# Altium schematic sheet C-07 PWR MGR.SchDoc
size 513 x 386 mm
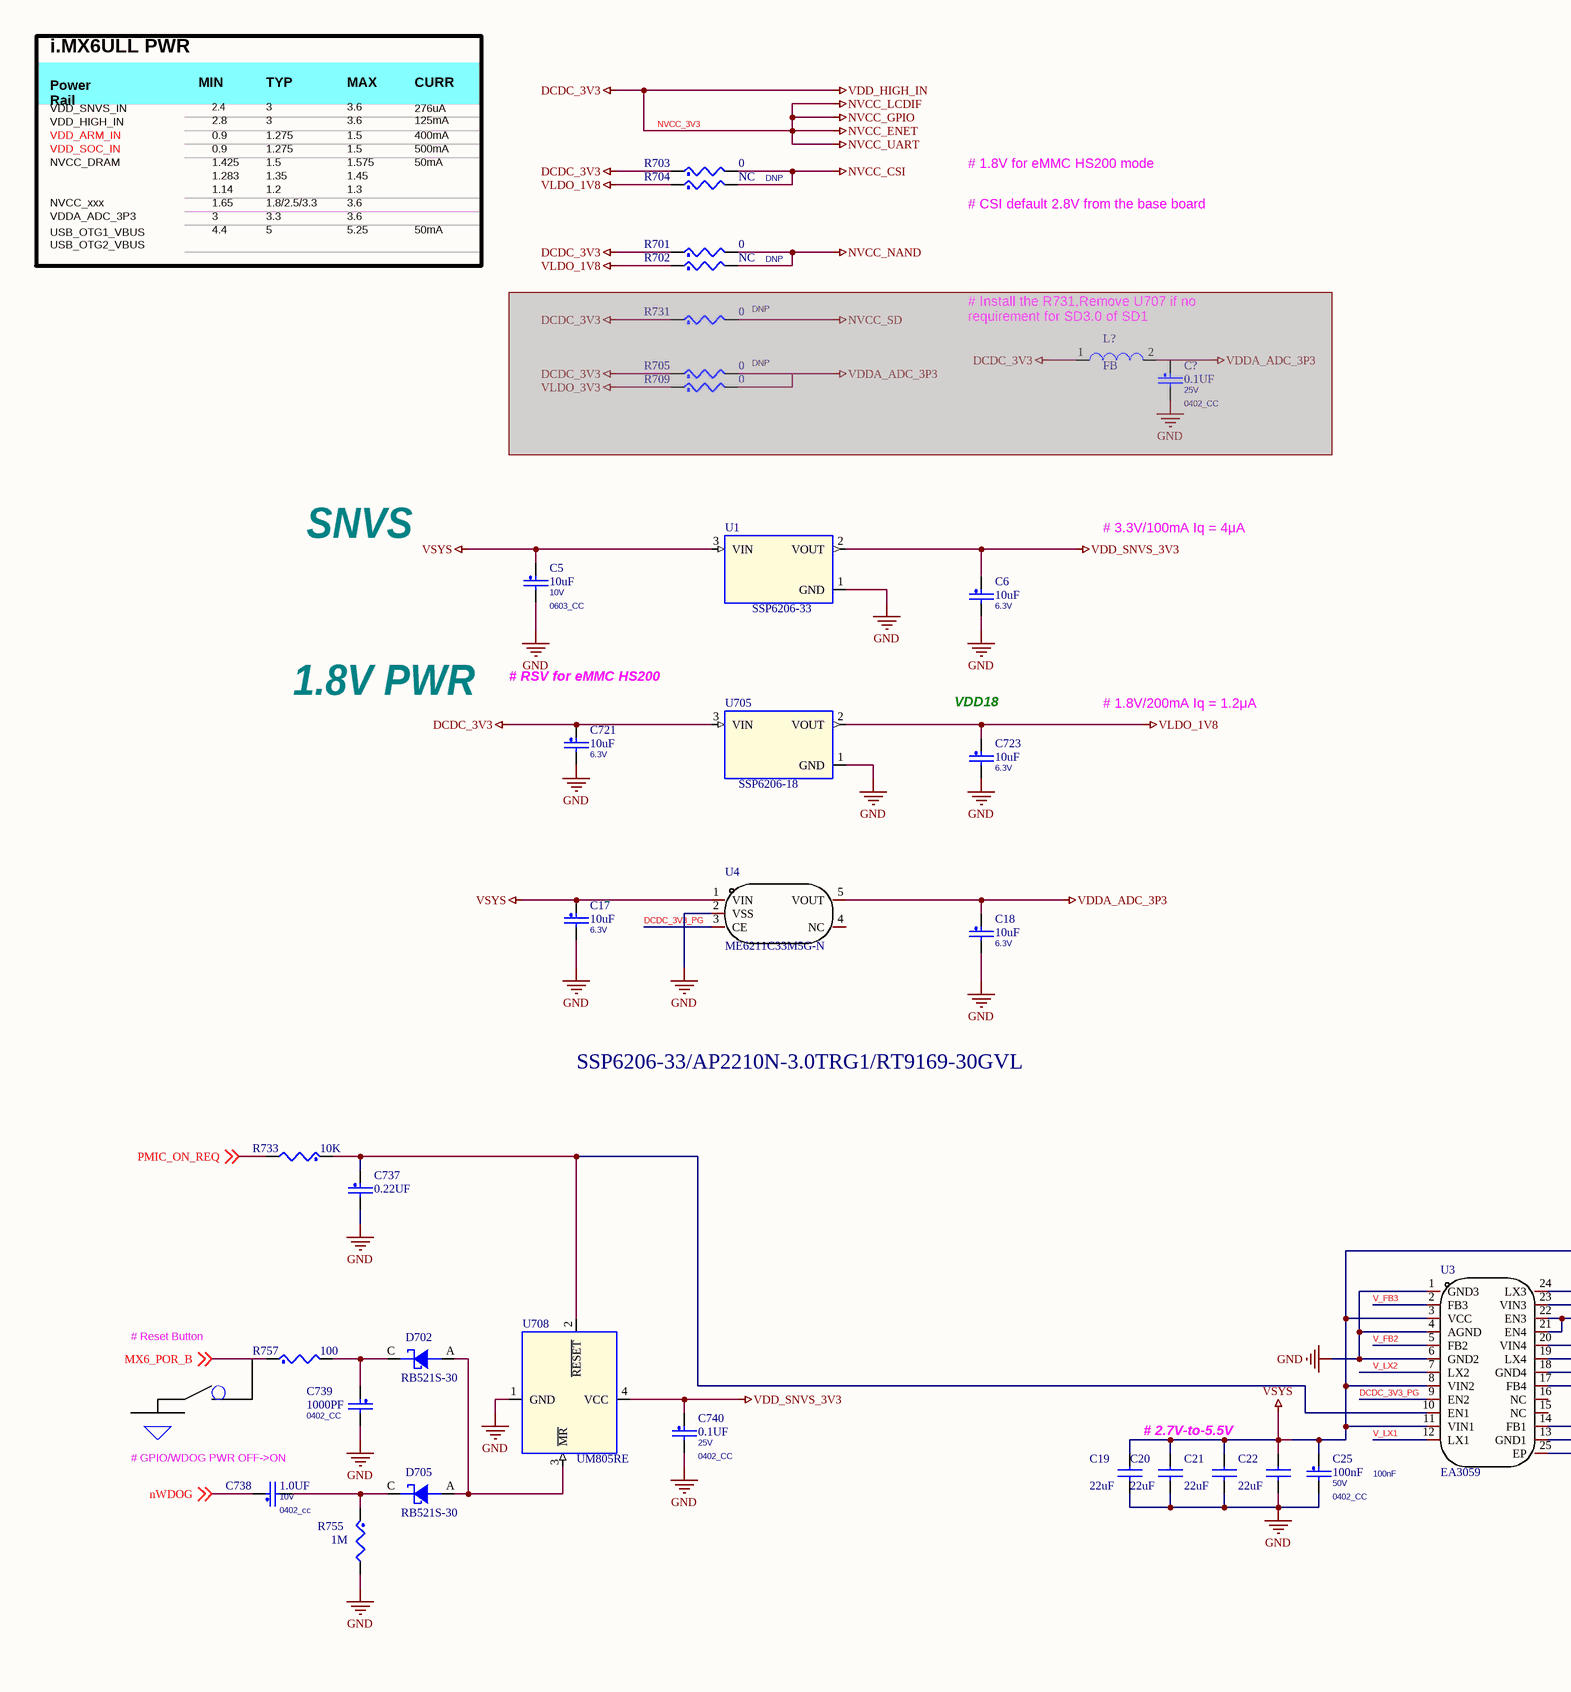
[diagram p0: C-07 PWR MGR.SchDoc, left]
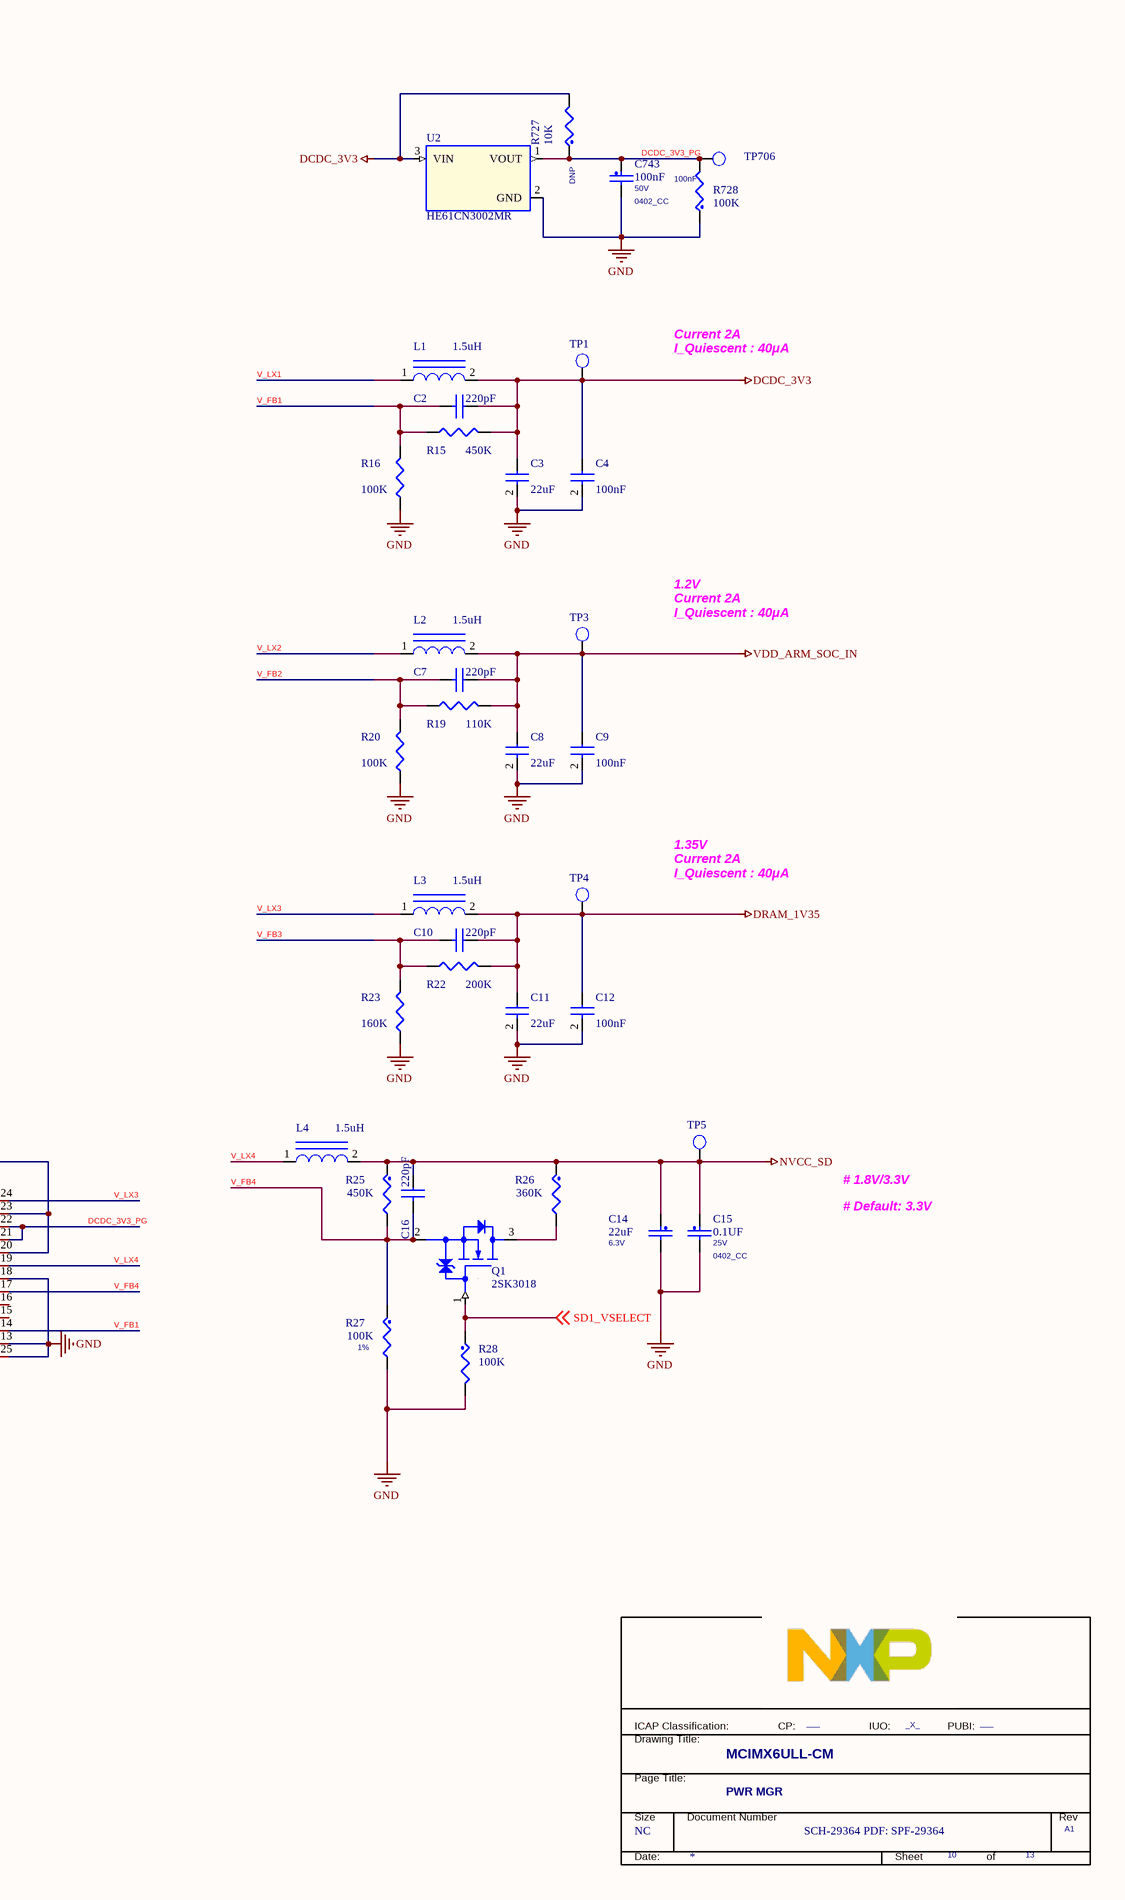
[diagram p1: C-07 PWR MGR.SchDoc, right]

## Parts
*  PageTitle: PWR MGR  Page Count: 13  Page Number: 10  Page Size: NC  Title: MCIMX6ULL-CM  RevCode: A1  Doc: SCH-29364 PDF: SPF-29364  FCP: ___  FIUO: _X_  (hidden comment: TitleBlock_FS)  (graphical)
C2  220pF  [0402T_C]
C3  22uF  [0603_CC]
C4  100nF  [0402T_C]
C5  10uF  VOLTAGE: 10V  PCB Footprint: 0603_CC  [0402T_C]
C6  10uF  voltage rating: 6.3V  [0402T_C]
C7  220pF  [0402T_C]
C8  22uF  [0603_CC]
C9  100nF  [0402T_C]
C10  220pF  [0402T_C]
C11  22uF  [0603_CC]
C12  100nF  [0402T_C]
C14  22uF  voltage rating: 6.3V  [0603_CC]
C15  0.1UF  VOLTAGE: 25V  PCB Footprint: 0402_CC  [0402T_C]
C16  220pF  [0402T_C]
C17  10uF  voltage rating: 6.3V  [0402T_C]
C18  10uF  voltage rating: 6.3V  [0402T_C]
C19  22uF  [0603_CC]
C20  22uF  [0603_CC]
C21  22uF  [0603_CC]
C22  22uF  [0603_CC]
C25  100nF  VOLTAGE: 50V  PCB Footprint: 0402_CC  [0402T_C]
C721  10uF  voltage rating: 6.3V  [0402T_C]
C723  10uF  voltage rating: 6.3V  [0402T_C]
C737  0.22UF  [0402T_C]
C738  1.0UF  VOLTAGE: 10V  PCB Footprint: 0402_cc  [0402T_C]
C739  1000PF  PCB Footprint: 0402_CC  [0402T_C]
C740  0.1UF  VOLTAGE: 25V  PCB Footprint: 0402_CC  [0402T_C]
C743  100nF  VOLTAGE: 50V  PCB Footprint: 0402_CC  [0402T_C]
C?  0.1UF  VOLTAGE: 25V  [0402_CC]  (masked out: inside a compile mask, not in the netlist)
D702  RB521S-30  [SOD-523]
D705  RB521S-30  [SOD-523]
L1  1.5uH  [IND-SMD_L2.5-W2.0_YXMBL252010P]
L2  1.5uH  [IND-SMD_L2.5-W2.0_YXMBL252010P]
L3  1.5uH  [IND-SMD_L2.5-W2.0_YXMBL252010P]
L4  1.5uH  [IND-SMD_L2.5-W2.0_YXMBL252010P]
L?  FB  [L0603]  (masked out: inside a compile mask, not in the netlist)
Q1  2SK3018  [SOT-23]
R15  450K  [0402T_C]
R16  100K  [0402T_C]
R19  110K  [0402T_C]
R20  100K  [0402T_C]
R22  200K  [0402T_C]
R23  160K  [0402T_C]
R25  450K  [0402T_C]
R26  360K  [0402T_C]
R27  100K  Tolerance: 1%  [0402T_C]
R28  100K  [0402T_C]
R701  0  [0402T_C]
R702  NC  ASSY_OPT: DNP  [0402T_C]
R703  0  [0402T_C]
R704  NC  ASSY_OPT: DNP  [0402T_C]
R705  0  ASSY_OPT: DNP  [0402_CC]  (masked out: inside a compile mask, not in the netlist)
R709  0  [0402_CC]  (masked out: inside a compile mask, not in the netlist)
R727  10K  ASSY_OPT: DNP  [0402T_C]
R728  100K  [0402T_C]
R731  0  ASSY_OPT: DNP  [0402_CC]  (masked out: inside a compile mask, not in the netlist)
R733  10K  [0402T_C]
R755  1M  [0402T_C]
R757  100  [0402T_C]
TP1  TP_35MIL  [TPAD_015]  (value not drawn)
TP3  TP_35MIL  [TPAD_015]  (value not drawn)
TP4  TP_35MIL  [TPAD_015]  (value not drawn)
TP5  TP_35MIL  [TPAD_015]  (value not drawn)
TP706  TP_35MIL  [testpoint_35mil]  (value not drawn)
U1  SSP6206-33  [SOT-23]
U2  HE61CN3002MR  [SOT-23]
U3  EA3059  [VQFN-24_L4.0-W4.0-P0.50-TL-EP2.5]
U4  ME6211C33M5G-N  [SOT23-5]
U705  SSP6206-18  [SOT-23]
U708  UM805RE  [SOT143-1]

## Nets
DRAM_1V35: C10.1 C11.1 C12.1 L3.2 R22.2 TP4.1(TP)
GND: C3.2 C4.2 C5.2 C6.2 C8.2 C9.2 C11.2 C12.2 C14.2 C15.2 C17.2 C18.2 C19.2 C20.2 C21.2 C22.2 C25.2 C721.2 C723.2 C737.2 C739.2 C740.2 C743.2 R16.2 R20.2 R23.2 R27.2 R28.2 R728.1 R755.2 U1.1(GND) U2.2(GND) U3.1(GND3) U3.4(AGND) U3.6(GND2) U3.13(GND1) U3.18(GND4) U3.25(EP) U4.2(VSS) U705.1(GND) U708.1(GND)
NVCC_3V3: C2.1 C3.1 C4.1 C721.1 L1.2 R15.2 R701.1 R703.1 R727.2 TP1.1(TP) U2.3(VIN) U705.3(VIN)  [also labelled DCDC_3V3, NVCC_ENET, NVCC_GPIO, NVCC_LCDIF, NVCC_UART, VDD_HIGH_IN]
NVCC_CSI: R703.2 R704.2
NVCC_NAND: R701.2 R702.2
NVCC_SD: C14.1 C15.1 C16.1 L4.2 R25.1 R26.1 TP5.1(TP)
VDD_ARM_SOC_IN: C7.1 C8.1 C9.1 L2.2 R19.2 TP3.1(TP)
VDD_SNVS_3V3: C6.1 C740.1 U1.2(VOUT) U708.4(VCC)
VDDA_ADC_3P3: C18.1 U4.5(VOUT)
VLDO_1V8: C723.1 R702.1 R704.1 U705.2(VOUT)
VSYS: C5.1 C17.1 C19.1 C20.1 C21.1 C22.1 C25.1 U1.3(VIN) U3.3(VCC) U3.8(VIN2) U3.11(VIN1) U3.20(VIN4) U3.23(VIN3) U4.1(VIN)
DCDC_3V3_PG: C743.1 R727.1 R728.2 TP706.1(TP) U2.1(VOUT) U3.9(EN2) U3.21(EN4) U3.22(EN3) U4.3(CE)
MX6_POR_B: R757.1 ; off-sheet MX6_POR_B
nWDOG: C738.1 ; off-sheet nWDOG
PMIC_ON_REQ: R733.2 ; off-sheet PMIC_ON_REQ
SD1_VSELECT: Q1.1(GATE) R28.1 ; off-sheet SD1_VSELECT
V_FB1: C2.2 R15.1 R16.1 U3.14(FB1)
V_FB2: C7.2 R19.1 R20.1 U3.5(FB2)
V_FB3: C10.2 R22.1 R23.1 U3.2(FB3)
V_FB4: C16.2 Q1.2(SOURCE) R25.2 R27.1 U3.17(FB4)
V_LX1: L1.1 U3.12(LX1)
V_LX2: L2.1 U3.7(LX2)
V_LX3: L3.1 U3.24(LX3)
V_LX4: L4.1 U3.19(LX4)
NetC737_1: C737.1 R733.1 U3.10(EN1) U708.2(~{RESET})
NetC738_2: C738.2 D705.C R755.1
NetC739_1: C739.1 D702.C R757.2
NetD702_A: D702.A D705.A U708.3(~{MR})
NetQ1_3: Q1.3(DRAIN) R26.2

Not connected (* = marked no-connect by the designer): U3 15(NC) 16(NC); U4 4(NC)

## Notes on the sheet
- i.MX6ULL PWR
- VDD_SNVS_IN
- VDD_HIGH_IN
- Power
  Rail
- MIN
- 2.4
- 2.8
- TYP
- 3
- MAX
- 3.6
- CURR
- 276uA
- 125mA
- VDD_SOC_IN
- VDD_ARM_IN
- NVCC_DRAM
- 0.9
- 1.425
- 1.283
- 1.14
- 1.275
- 1.5
- 1.35
- 1.2
- 1.575
- 1.45
- 1.3
- 400mA
- 500mA
- 50mA
- # 1.8V for eMMC HS200 mode
- USB_OTG1_VBUS
  USB_OTG2_VBUS
- NVCC_xxx
- VDDA_ADC_3P3
- 1.65
- 4.4
- 1.8/2.5/3.3
- 3.3
- 5
- 5.25
- # CSI default 2.8V from the base board
- # Install the R731,Remove U707 if no
  requirement for SD3.0 of SD1
- Current 2A
  I_Quiescent : 40μA
- # 3.3V/100mA Iq = 4μA
- SNVS
- 1.8V PWR
- # RSV for eMMC HS200
- (near C723) VDD18
- # 1.8V/200mA Iq = 1.2μA
- 1.2V
  Current 2A
  I_Quiescent : 40μA
- 1.35V
  Current 2A
  I_Quiescent : 40μA
- SSP6206-33/AP2210N-3.0TRG1/RT9169-30GVL
- # 1.8V/3.3V
- # Reset Button
- # Default: 3.3V
- (near C738) # GPIO/WDOG PWR OFF->ON
- # 2.7V-to-5.5V
- (in symbol TitleBlock_FS) ICAP Classification:; CP:; IUO:; PUBI:; Drawing Title:; Page Title:; Size; Document Number; Rev; Date:; Sheet; of

## Library data of the parts
* = TitleBlock_FS: OrgAddr2: Austin, TX 78735-8598; OrgAddr1: 6501 William Cannon Drive West; OrgName: Freescale Semiconductor; Page Create Date: March  8, 1995; PUBI: ___; Page Modify Date: *
C2-C4 C7-C12 C16 C19-C22 = CAP NP: PCB Footprint: C0603
C5 = CAP_NP: CAP CER 10UF 10V 20% X5R 0603; CLASS: DISCRETE; FPLIST: CC0603_OV,CC0603,0603_CC; CAD_APPROVED: Yes; MFG_PN01: LMK107BJ106MALTD; MFG_NAME01: TAIYO YUDEN; AGILE_PN: 150-78609; HEIGHT: 1.016MM; ROHS: Yes
C6 C14 C17 C721 = CAP_NP: CAP CER 4.7UF 6.3V 20% X5R 0402; CLASS: DISCRETE; FPLIST: CC0402_25,CC0402_HD,0402_CC; CAD_APPROVED: Yes; MFG_PN01: C1005X5R0J475M050BC; MFG_NAME01: TDK; AGILE_PN: 150-78463; PCB Footprint: 0402_CC; HEIGHT: 0.65MM; ROHS: Yes; Tolerance: 20%; VOLTAGE: 6.3V
C15 C? = CAP_NP: CAP CER 0.1UF 25V 10% X5R 0402; CLASS: DISCRETE; AGILE_PN: 150-78633; MFG_NAME01: YAGEO AMERICA; MFG_PN01: CC0402KRX5R8BB104; CAD_APPROVED: Yes; FPLIST: CC0402_25,CC0402_HD,0402_CC; Tolerance: 10%; ROHS: Yes; HEIGHT: 0.55MM
  C?: PCB Footprint: 0402_CC
C18 C723 = CAP_NP: CAP CER 4.7UF 6.3V 20% X5R 0402; CLASS: DISCRETE; AGILE_PN: 150-78463; MFG_NAME01: TDK; MFG_PN01: C1005X5R0J475M050BC; CAD_APPROVED: Yes; FPLIST: CC0402_25,CC0402_HD,0402_CC; PCB Footprint: 0402_CC; VOLTAGE: 6.3V; Tolerance: 20%; ROHS: Yes; HEIGHT: 0.65MM
C25 C743 = CAP_NP: CAP CER 50V 5% C0G 0402; CLASS: DISCRETE; AGILE_PN: 150-76334; MFG_NAME01: MURATA; MFG_PN01: GRM1555C1H102JA01D; CAD_APPROVED: Yes; FPLIST: CC0402_25,CC0402_HD,0402_CC; ASSY_OPT: 100nF; Tolerance: 5%; ROHS: Yes; HEIGHT: 0.55MM
C737 = CAP_NP: CAP CER 0.22UF 10V 10% X5R 0402; CLASS: DISCRETE; PCB Footprint: 0402_CC; AGILE_PN: 150-77358; MFG_NAME01: NIC COMPONENTS CORP; MFG_PN01: NMC0402X5R224K10TRPF; CAD_APPROVED: Yes; FPLIST: CC0402_25,CC0402_HD,0402_CC; Tolerance: 10%; ROHS: Yes; HEIGHT: 0.55MM; VOLTAGE: 10V
C738 = CAP_NP: CAP CER 1.0UF 10V 10% X5R 0402; CLASS: DISCRETE; AGILE_PN: 150-75772; MFG_NAME01: YAGEO AMERICA; MFG_PN01: CC0402KRX5R6BB105; CAD_APPROVED: Yes; FPLIST: CC0402_25,CC0402_HD,0402_CC; ROHS: Yes; HEIGHT: 0.6MM
C739 = CAP_NP: CAP CER 1000PF 50V 5% C0G 0402; CLASS: DISCRETE; FPLIST: CC0402_25,CC0402_HD,0402_CC; CAD_APPROVED: Yes; MFG_PN01: GRM1555C1H102JA01D; MFG_NAME01: MURATA; AGILE_PN: 150-76334; VOLTAGE: 50V; HEIGHT: 0.55MM; ROHS: Yes; Tolerance: 5%
C740 = CAP_NP: CAP CER 0.1UF 25V 10% X5R 0402; CLASS: DISCRETE; FPLIST: CC0402_25,CC0402_HD,0402_CC; CAD_APPROVED: Yes; MFG_PN01: CC0402KRX5R8BB104; MFG_NAME01: YAGEO AMERICA; AGILE_PN: 150-78633; HEIGHT: 0.55MM; ROHS: Yes; Tolerance: 10%
D702 = DIODE_SCHTKY: DIODE SCH 200MA 30V SOD-523; CLASS: IC; CAD_APPROVED: Yes; MFG_PN01: RB521S-30TE61; MFG_NAME01: ROHM; AGILE_PN: 480-75983; PCB Footprint: SOD523; HEIGHT: 0.7MM; ROHS: Yes
D705 = DIODE_SCHTKY: DIODE SCH 200MA 30V SOD-523; CLASS: IC; AGILE_PN: 480-75983; MFG_NAME01: ROHM; MFG_PN01: RB521S-30TE61; CAD_APPROVED: Yes; PCB Footprint: SOD523; ROHS: Yes; HEIGHT: 0.7MM
L1-L4 = INDUCTOR IRON: PCB Footprint: SMTDR43
L? = INDUCTOR_Dup2: PCB Footprint: L0603
Q1 = 2SK3018: TRANS MOSFET N-CH 30V .1A SOT-323; CLASS: IC; AGILE_PN: 480-75317; MFG_NAME01: ROHM; MFG_PN01: 2SK3018T106; CAD_APPROVED: Yes; PCB Footprint: SOT323_3; ROHS: Yes; HEIGHT: 0.9MM
R15 R16 R19 R20 R22 R23 = R_Dup2: PCB Footprint: R0603
R25 = RES: RES MF 464K 1/10W 1% AEC-Q200 0402; CLASS: DISCRETE; Temp_Range: -55C to +155C; FPLIST: RC0402_25,RC0402_HD,0402_CC; CAD_APPROVED: Yes; MFG_PN01: RK73H1ETTP4643F; MFG_NAME01: KOA SPEER; AGILE_PN: 470-31135; PCB Footprint: 0402_CC; HEIGHT: 0.40 MM; ROHS: Yes; Tolerance: 1%
R26 = RES: RES MF 243K 1/10W 1% AEC-Q200 0402; CLASS: DISCRETE; Temp_Range: -55C to +155C; FPLIST: RC0402_25,RC0402_HD,0402_CC; CAD_APPROVED: Yes; MFG_PN01: RK73H1ETTP2433F; MFG_NAME01: KOA SPEER; AGILE_PN: 470-31102; PCB Footprint: 0402_CC; HEIGHT: 0.40 MM; ROHS: Yes; Tolerance: 1%
R27 = RES: RES MF 200K 1/10W 1% AEC-Q200 0402; CLASS: DISCRETE; Temp_Range: -55C to +155C; AGILE_PN: 470-31093; MFG_NAME01: KOA SPEER; MFG_PN01: RK73H1ETTP2003F; CAD_APPROVED: Yes; FPLIST: RC0402_25,RC0402_HD,0402_CC; PCB Footprint: 0402_CC; HEIGHT: 0.40 MM; ROHS: Yes
R28 = RES: RES MF 100K 1/16W 5% 0402; CLASS: DISCRETE; Temp_Range: -55C to +155C; AGILE_PN: 470-75597; MFG_NAME01: VENKEL COMPANY; MFG_PN01: CR0402-16W-104JT; CAD_APPROVED: Yes; FPLIST: RC0402_25,RC0402_HD,0402_CC; PCB Footprint: 0402_CC; HEIGHT: 0.40 MM; Tolerance: 5%; ROHS: Yes
R701-R703 = RES: RES MF ZERO OHM 1/16W 5% 0402; CLASS: DISCRETE; FPLIST: RC0402_25,RC0402_HD,RC0402_X2,0402_CC; CAD_APPROVED: Yes; MFG_PN01: MCR01MZPJ000; MFG_NAME01: ROHM; AGILE_PN: 470-75394; PCB Footprint: 0402_CC; HEIGHT: 0.45 MM; ROHS: Yes; Tolerance: 5%
R704 R727 R728 = RES: RES MF ZERO OHM 1/16W 5% 0402; CLASS: DISCRETE; AGILE_PN: 470-75394; MFG_NAME01: ROHM; MFG_PN01: MCR01MZPJ000; CAD_APPROVED: Yes; FPLIST: RC0402_25,RC0402_HD,RC0402_X2,0402_CC; PCB Footprint: 0402_CC; HEIGHT: 0.45 MM; Tolerance: 5%; ROHS: Yes
R705 R731 = RES: RES MF ZERO OHM 1/16W 5% 0402; CLASS: DISCRETE; AGILE_PN: 470-75394; MFG_NAME01: ROHM; MFG_PN01: MCR01MZPJ000; CAD_APPROVED: Yes; FPLIST: RC0402_25,RC0402_HD,RC0402_X2,0402_CC; HEIGHT: 0.45 MM; Tolerance: 5%; ROHS: Yes; PCB Footprint: 0402_CC
R709 = RES: RES MF ZERO OHM 1/16W 5% 0402; CLASS: DISCRETE; FPLIST: RC0402_25,RC0402_HD,RC0402_X2,0402_CC; CAD_APPROVED: Yes; MFG_PN01: MCR01MZPJ000; MFG_NAME01: ROHM; AGILE_PN: 470-75394; HEIGHT: 0.45 MM; ROHS: Yes; Tolerance: 5%; PCB Footprint: 0402_CC
R733 = RES: RES MF 10K 1/16W 5% 0402; CLASS: DISCRETE; FPLIST: RC0402_25,RC0402_HD,0402_CC; CAD_APPROVED: Yes; MFG_PN01: CRCW040210K0JNED; MFG_NAME01: VISHAY INTERTECHNOLOGY; AGILE_PN: 470-75557; PCB Footprint: 0402_CC; HEIGHT: 0.4 MM; ROHS: Yes; Tolerance: 5%
R755 = RES: RES MF 1M 1/10W 5% AEC-Q200 0402; CLASS: DISCRETE; Temp_Range: -55&#8451; to 155&#8451;; AGILE_PN: 470-79978; MFG_NAME01: KOA SPEER; MFG_PN01: RK73B1ETTP105J; CAD_APPROVED: Yes; FPLIST: RC0402_25,RC0402_HD,0402_CC; PCB Footprint: 0402_CC; HEIGHT: 0.4MM; Tolerance: 5%; ROHS: Yes
R757 = RES: RES MF 100 OHM 1/16W 1% 0402; CLASS: DISCRETE; AGILE_PN: 470-30454; MFG_NAME01: THYE MING TECH CO LTD; MFG_PN01: CR-02FL6--100R; CAD_APPROVED: Yes; FPLIST: RC0402_25,RC0402_HD,0402_CC; PCB Footprint: 0402_CC; HEIGHT: 0.4 MM; Tolerance: 1%; ROHS: Yes
TP1 TP3-TP5 = T POINT R: TEST POINT PAD .035 SMT, no part to order; CLASS: IC; AGILE_PN: 510-75618; CAD_APPROVED: Yes; PCB Footprint: testpoint_35mil; ROHS: Yes; HEIGHT: 0.1MM
TP706 = T POINT R: TEST POINT PAD .035 SMT, no part to order; CLASS: IC; CAD_APPROVED: Yes; AGILE_PN: 510-75618; HEIGHT: 0.1MM; ROHS: Yes; PCB Footprint: testpoint_35mil
U1 = RT9169_3P: IC VREG LDO 3.3V 100mA 2-6V SOT-23-3; AGILE_PN: 315-80510; MFG_NAME01: Richtek; MFG_PN01: RT9169-33GVL; CAD_APPROVED: Yes; PCB Footprint: sot23-3-1p95; CLASS: IC; ROHS: Yes; HEIGHT: 1.295MM
U2 U705 = RT9169_3P: IC VREG LDO 1.8V 100mA 2-6V SOT-23-3; CAD_APPROVED: Yes; MFG_PN01: RT9169-18GVL; MFG_NAME01: Richtek; AGILE_PN: 315-80514; PCB Footprint: sot23-3-1p95; CLASS: IC; HEIGHT: 1.295MM; ROHS: Yes
U3 = EA3059: 4 路PMU, 输入2.7~5.5V, 2A电流, 输出1.1~3.3可调.; Manufacturer: everanalog(申风); Add into BOM: yes; Name: EA3059; Symbol: EA3059; Device: EA3059; LCSC Part Name: EA3059; Supplier Part: C111586; Manufacturer Part: EA3059; Supplier Footprint: QFN-24-EP(4x4); JLCPCB Part Class: Extended Part; Datasheet: https://atta.szlcsc.com/upload/public/pdf/source/20170522/1495423553388.pdf; Supplier: LCSC; Convert to PCB: yes
U4 = ME6211C33M5G-N: 最大输入电压:6V;压降(max):260mV @ 200mA(typ);输出电压(可调):-;静态电流(Iq):-;输出类型:固定;输出电压(固定):3.3V;; Manufacturer: MICRONE(南京微盟); Add into BOM: yes; Voltage - Input (Max): 6V; Current - Supply (Max): 60μA; Output Current (Max): 500mA; Output Configuration: 正; Ripple Rejection (PSRR): 70dB ~ 62dB(1kHz ~ 10kHz); Number of Output Channels: 1; Voltage - Output (Fixed): 3.3V; Name: ME6211C33M5G-N; Symbol: ME6211C33M5G-N; Device: ME6211C33M5G-N; LCSC Part Name: ME6211C33M5G-N; Supplier Part: C82942; Manufacturer Part: ME6211C33M5G-N; Supplier Footprint: SOT-23-5; JLCPCB Part Class: Extended Part; Datasheet: https://atta.szlcsc.com/upload/public/pdf/source/20170918/C82942_1505727073070976520.pdf; Supplier: LCSC; Convert to PCB: yes; Voltage Dropout (Max): 260mV @ 200mA(typ); Voltage - Output (adj): -; Quiescent Current (Iq): -; Output Type: 固定; Operating Temperature: -40℃~150℃; Enabling feet: -
U708 = UM805_4P: IC VOLT MONITOR 2.63V VTH RST 1-5.5V SOT143; AGILE_PN: 315-80564; MFG_NAME01: Union Semiconductor, Inc; CAD_APPROVED: Yes; PCB Footprint: sot_143; CLASS: IC; MFG_PN01: UM805RE; ROHS: Yes; HEIGHT: 1.22MM